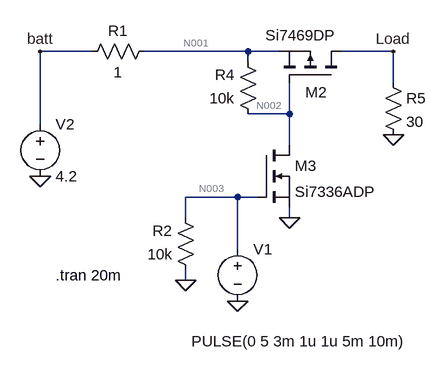
[diagram p0: schematic battery_load_enabler.asc]
battery_load_enabler.asc, the LTspice schematic file:
Version 4
SHEET 1 1192 680
WIRE 304 16 224 16
WIRE 544 16 384 16
WIRE 592 16 544 16
WIRE 768 16 688 16
WIRE 544 32 544 16
WIRE 768 64 768 16
WIRE 608 112 608 64
WIRE 608 112 544 112
WIRE 224 128 224 16
WIRE 608 160 608 112
WIRE 528 240 448 240
WIRE 560 240 528 240
WIRE 448 272 448 240
WIRE 608 272 608 256
WIRE 528 320 528 240
WIRE 448 368 448 352
FLAG 224 208 0
FLAG 528 400 0
FLAG 224 16 batt
FLAG 608 272 0
FLAG 768 144 0
FLAG 768 16 Load
FLAG 448 368 0
SYMBOL voltage 528 304 R0
WINDOW 3 -71 158 Left 2
WINDOW 123 0 0 Left 0
WINDOW 39 0 0 Left 0
SYMATTR Value PULSE(0 5 3m 1u 1u 5m 10m)
SYMATTR InstName V1
SYMBOL voltage 224 112 R0
WINDOW 123 0 0 Left 0
WINDOW 39 0 0 Left 0
SYMATTR InstName V2
SYMATTR Value 4.2
SYMBOL res 288 32 R270
WINDOW 0 32 56 VTop 2
WINDOW 3 0 56 VBottom 2
SYMATTR InstName R1
SYMATTR Value 1
SYMBOL pmos 688 64 M270
WINDOW 0 -15 56 VLeft 2
WINDOW 3 73 117 VLeft 2
SYMATTR InstName M2
SYMATTR Value Si7469DP
SYMBOL res 560 128 R180
WINDOW 0 36 76 Left 2
WINDOW 3 36 40 Left 2
SYMATTR InstName R4
SYMATTR Value 10k
SYMBOL nmos 560 160 R0
SYMATTR InstName M3
SYMATTR Value Si7336ADP
SYMBOL res 752 48 R0
SYMATTR InstName R5
SYMATTR Value 30
SYMBOL res 464 368 R180
WINDOW 0 36 76 Left 2
WINDOW 3 36 40 Left 2
SYMATTR InstName R2
SYMATTR Value 10k
TEXT 248 360 Left 2 !.tran 20m

The netlist it stands for:
* battery_load_enabler.asc
V1 N003 0 PULSE(0 5 3m 1u 1u 5m 10m)
V2 batt 0 4.2
R1 batt N001 1
M2 Load N002 N001 N001 Si7469DP
R4 N002 N001 10k
M3 N002 N003 0 0 Si7336ADP
R5 Load 0 30
R2 0 N003 10k
.model NMOS NMOS
.model PMOS PMOS
.lib standard.mos
.tran 20m
.backanno
.end

* Results of the author's LTspice run, read from the files saved beside the schematic
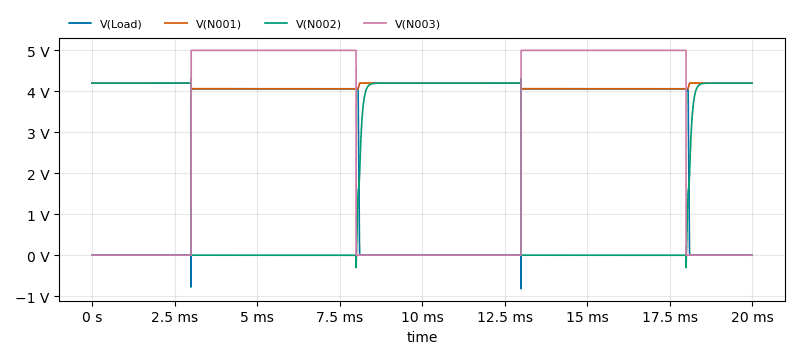
[diagram p1: Transient Analysis of battery_load_enabler.asc, plotted from the saved traces]
* Transient Analysis, 1 run:
*   V(Load): min -821.5 mV, max 4.061 V, average 2.065 V, rms 2.893 V, last -1.215 µV
*   V(N001): min 3.722 V, max 4.201 V, average 4.131 V, rms 4.132 V, last 4.2 V
*   V(N002): min -304.3 mV, max 4.311 V, average 2.05 V, rms 2.92 V, last 4.2 V
*   V(N003): min 0 V, max 5 V, average 2.501 V, rms 3.536 V, last 0 V